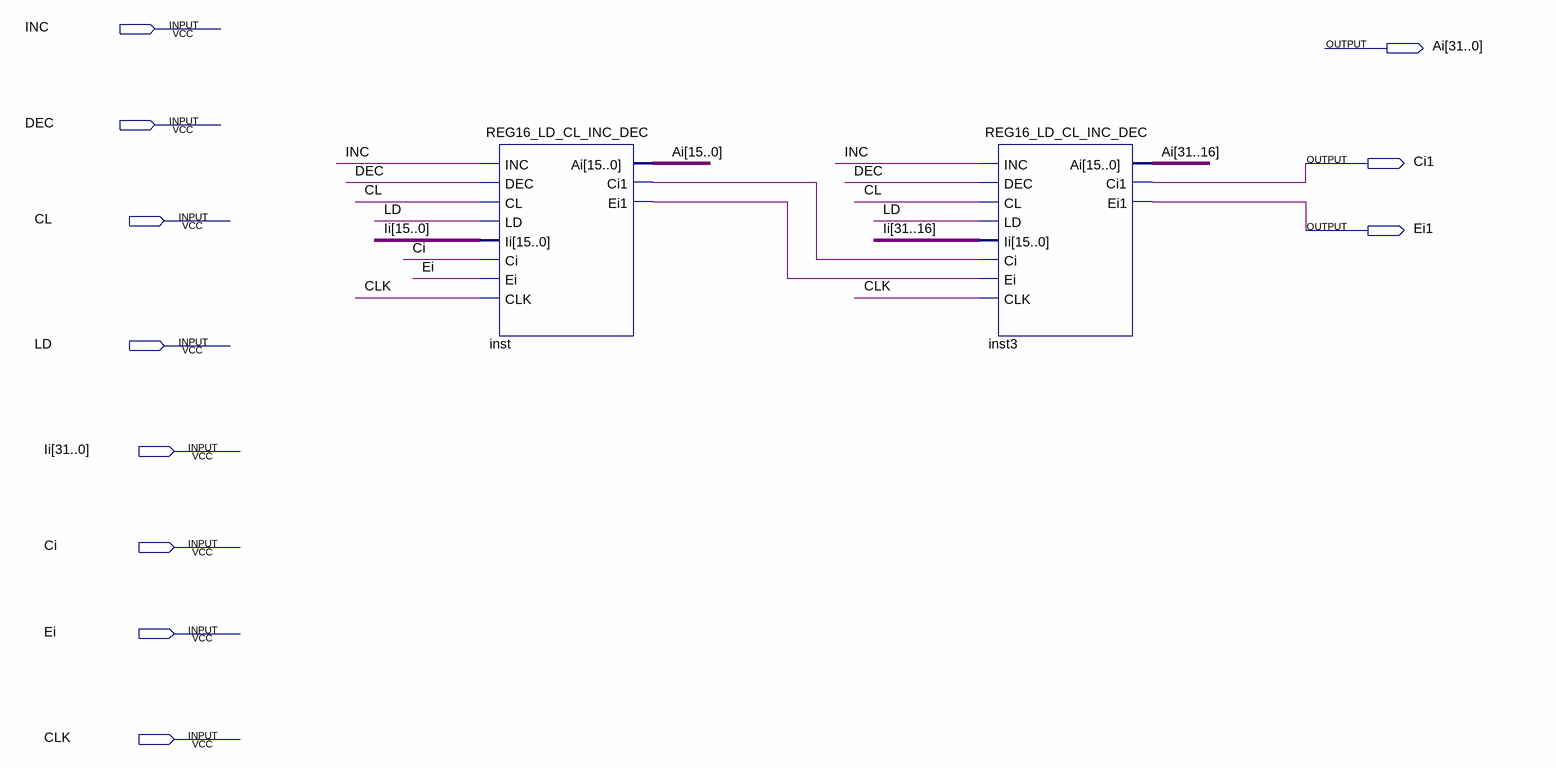
[diagram p0: schematic sheet]
// Quartus schematic REG32_LD_CL_INC_DEC.bdf as structural Verilog: 2 symbols, 11 pins
module REG32_LD_CL_INC_DEC (
  input  INC,
  input  DEC,
  input  CL,
  input  LD,
  input  [31:0] Ii,
  input  Ci,
  input  Ei,
  input  CLK,
  output [31:0] Ai,
  output Ci1,
  output Ei1
);

  wire inst_ci1, inst_ei1;

  REG16_LD_CL_INC_DEC inst (
    .INC(INC), .DEC(DEC), .CL(CL), .LD(LD), .Ii(Ii[15:0]), .Ci(Ci), .Ei(Ei), .CLK(CLK), .Ai(Ai[15:0]),
    .Ci1(inst_ci1), .Ei1(inst_ei1));
  REG16_LD_CL_INC_DEC inst3 (
    .INC(INC), .DEC(DEC), .CL(CL), .LD(LD), .Ii(Ii[31:16]), .Ci(inst_ci1), .Ei(inst_ei1), .CLK(CLK),
    .Ai(Ai[31:16]), .Ci1(Ci1), .Ei1(Ei1));
endmodule
